# Altium schematic sheet OLEDCard_ChinaUS_Maker.SchDoc
size A
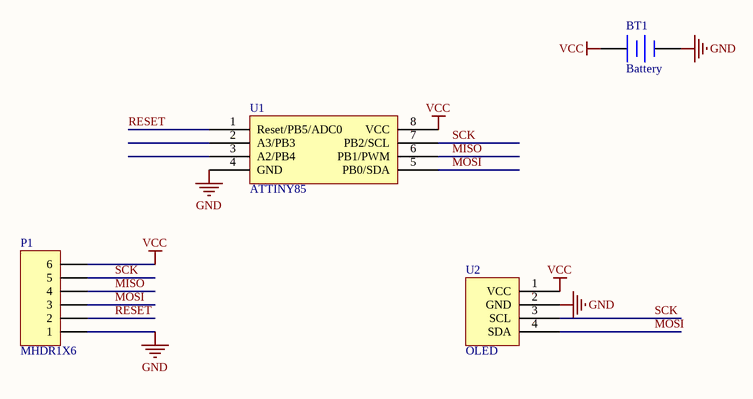
[diagram p0: OLEDCard_ChinaUS_Maker.SchDoc]

## Parts
BT1  Battery  [BATTCON_20MM_4LEGS]
P1  MHDR1X6  [HDR1X6]
U1  ATTINY85  [DIP-P8]
U2  OLED  [OLED]

## Nets
GND: BT1.2(-) P1.1 U1.4(GND) U2.2(GND)
VCC: BT1.1(+) P1.6 U1.8(VCC) U2.1(VCC)
MISO: P1.4 U1.6(PB1/PWM)
MOSI: P1.3 U1.5(PB0/SDA) U2.4(SDA)
RESET: P1.2 U1.1(Reset/PB5/ADC0)
SCK: P1.5 U1.7(PB2/SCL) U2.3(SCL)

Not connected (* = marked no-connect by the designer): U1 2(A3/PB3) 3(A2/PB4)

## Library data of the parts
BT1 = Battery: Multicell Battery; Published: 24-Mar-1999; LatestRevisionDate: 17-Jul-2002; LatestRevisionNote: Re-released for DXP Platform.; PackageReference: BAT-2; Publisher: Altium Limited; PackageDescription: Battery; 2 Leads
P1 = MHDR1X6: Header, 6-Pin; LatestRevisionDate: 17-Jul-2002; LatestRevisionNote: Re-released for DXP Platform.; Publisher: Altium Limited